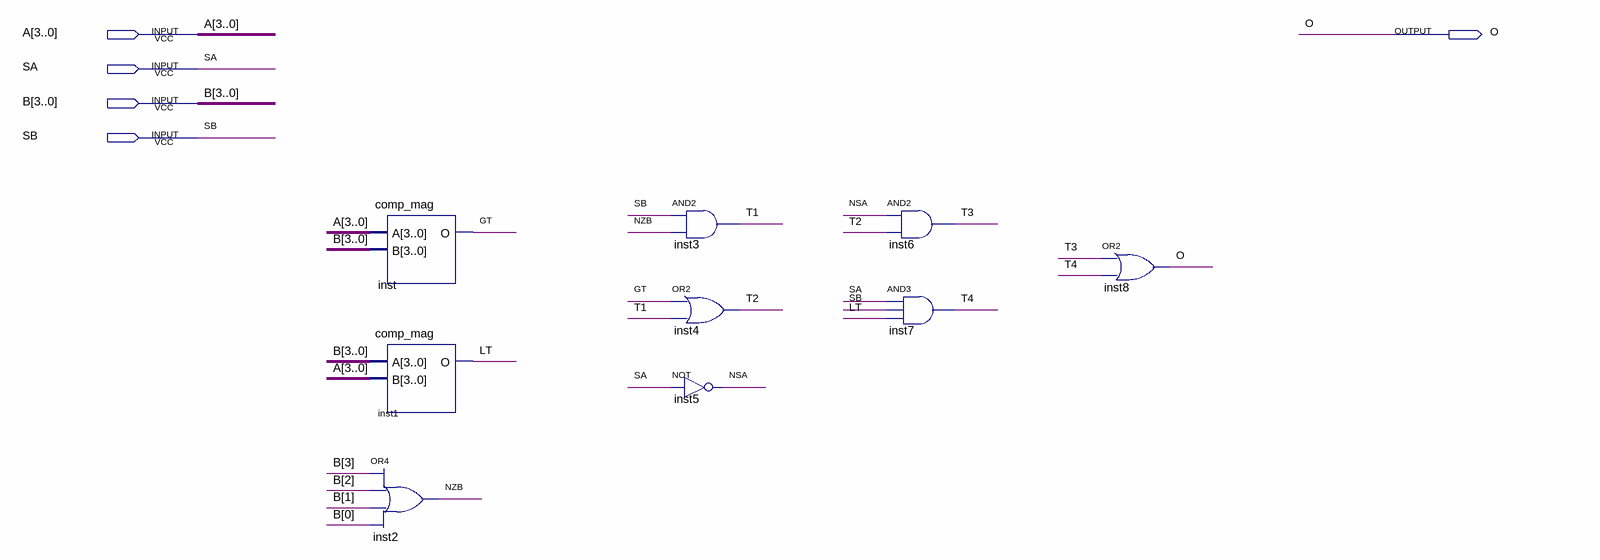
[diagram p0: schematic sheet]
// Quartus schematic comp_maior.bdf as structural Verilog: 9 symbols, 5 pins
module comp_maior (
  input  [3:0] A,
  input  SA,
  input  [3:0] B,
  input  SB,
  output O
);

  wire GT, LT, NSA, NZB, T1, T2, T3, T4;

  comp_mag inst (.A(A), .B(B), .O(GT));
  comp_mag inst1 (.A(B), .B(A), .O(LT));
  or inst2 (NZB, B[3], B[2], B[1], B[0]);
  and inst3 (T1, SB, NZB);
  or inst4 (T2, GT, T1);
  not inst5 (NSA, SA);
  and inst6 (T3, NSA, T2);
  and inst7 (T4, SA, SB, LT);
  or inst8 (O, T3, T4);
endmodule
